# Altium schematic sheet [8]-MODEM_MAIN.SchDoc
size A4
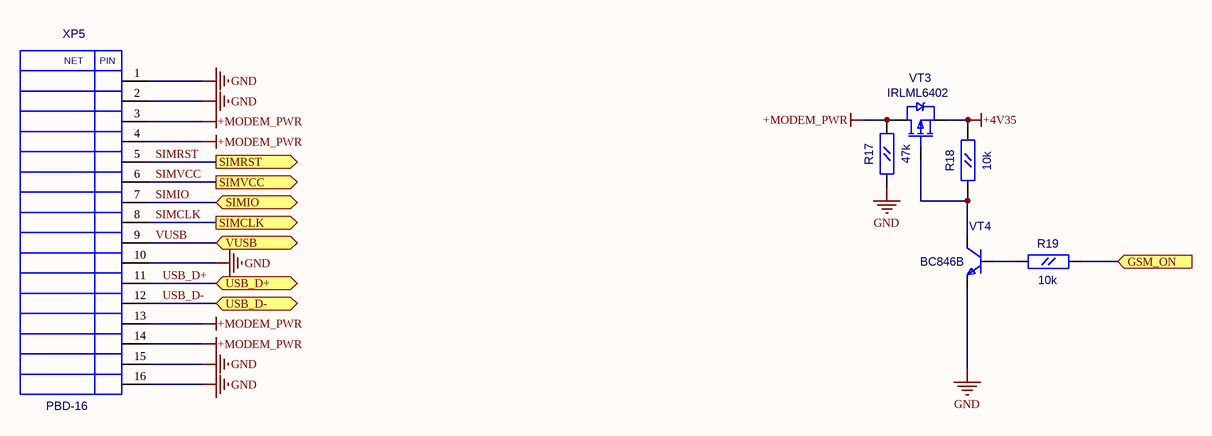
[diagram p0: [8]-MODEM_MAIN.SchDoc]

## Parts
R17  47k  [RC0603]
R18  10k  [RC0603]
R19  10k  [RC0603]
VT3  IRLML6402  [SOT-23(123)]
VT4  BC846B  [SOT-23(123)]
XP5  PBD-16  [PBD16]

## Ports
GSM_ON (in), SIMCLK (out), SIMIO (bidir), SIMRST (out), SIMVCC (out), USB_D+ (bidir), USB_D- (bidir), VUSB (bidir)

## Nets
+4V35: R18.2(B) VT3.2(S)
+MODEM_PWR: R17.2(B) VT3.3(D) XP5.3 XP5.4 XP5.13 XP5.14
GND: R17.1(A) VT4.2(E) XP5.1 XP5.2 XP5.10 XP5.15 XP5.16
GSM_ON: R19.2(B) ; port GSM_ON
SIMCLK: XP5.8 ; port SIMCLK
SIMIO: XP5.7 ; port SIMIO
SIMRST: XP5.5 ; port SIMRST
SIMVCC: XP5.6 ; port SIMVCC
USB_D+: XP5.11 ; port USB_D+
USB_D-: XP5.12 ; port USB_D-
VUSB: XP5.9 ; port VUSB
NetR18_1: R18.1(A) VT3.1(G) VT4.3(C)
NetR19_1: R19.1(A) VT4.1(B)

## Notes on the sheet
- (in symbol PBD-16) NET; PIN

## Library data of the parts
R17-R19 = RC0603
  R17: Value: 47k
  R18 R19: Value: 10k
VT3 = IRLML6402: HEXFET Power MOSFET; OriginalName: IRLML5103; ComponentField7: Published 8-Jun-2000; Value: IRLML6402
VT4 = BC846BLT1: ComponentField7: Published 29-Sep-2000; OriginalName: BC846BLT1; Value: BC846B
XP5 = PBD-16: Value: *